# Altium project DCAC.PrjPcb (part 4 of 11)
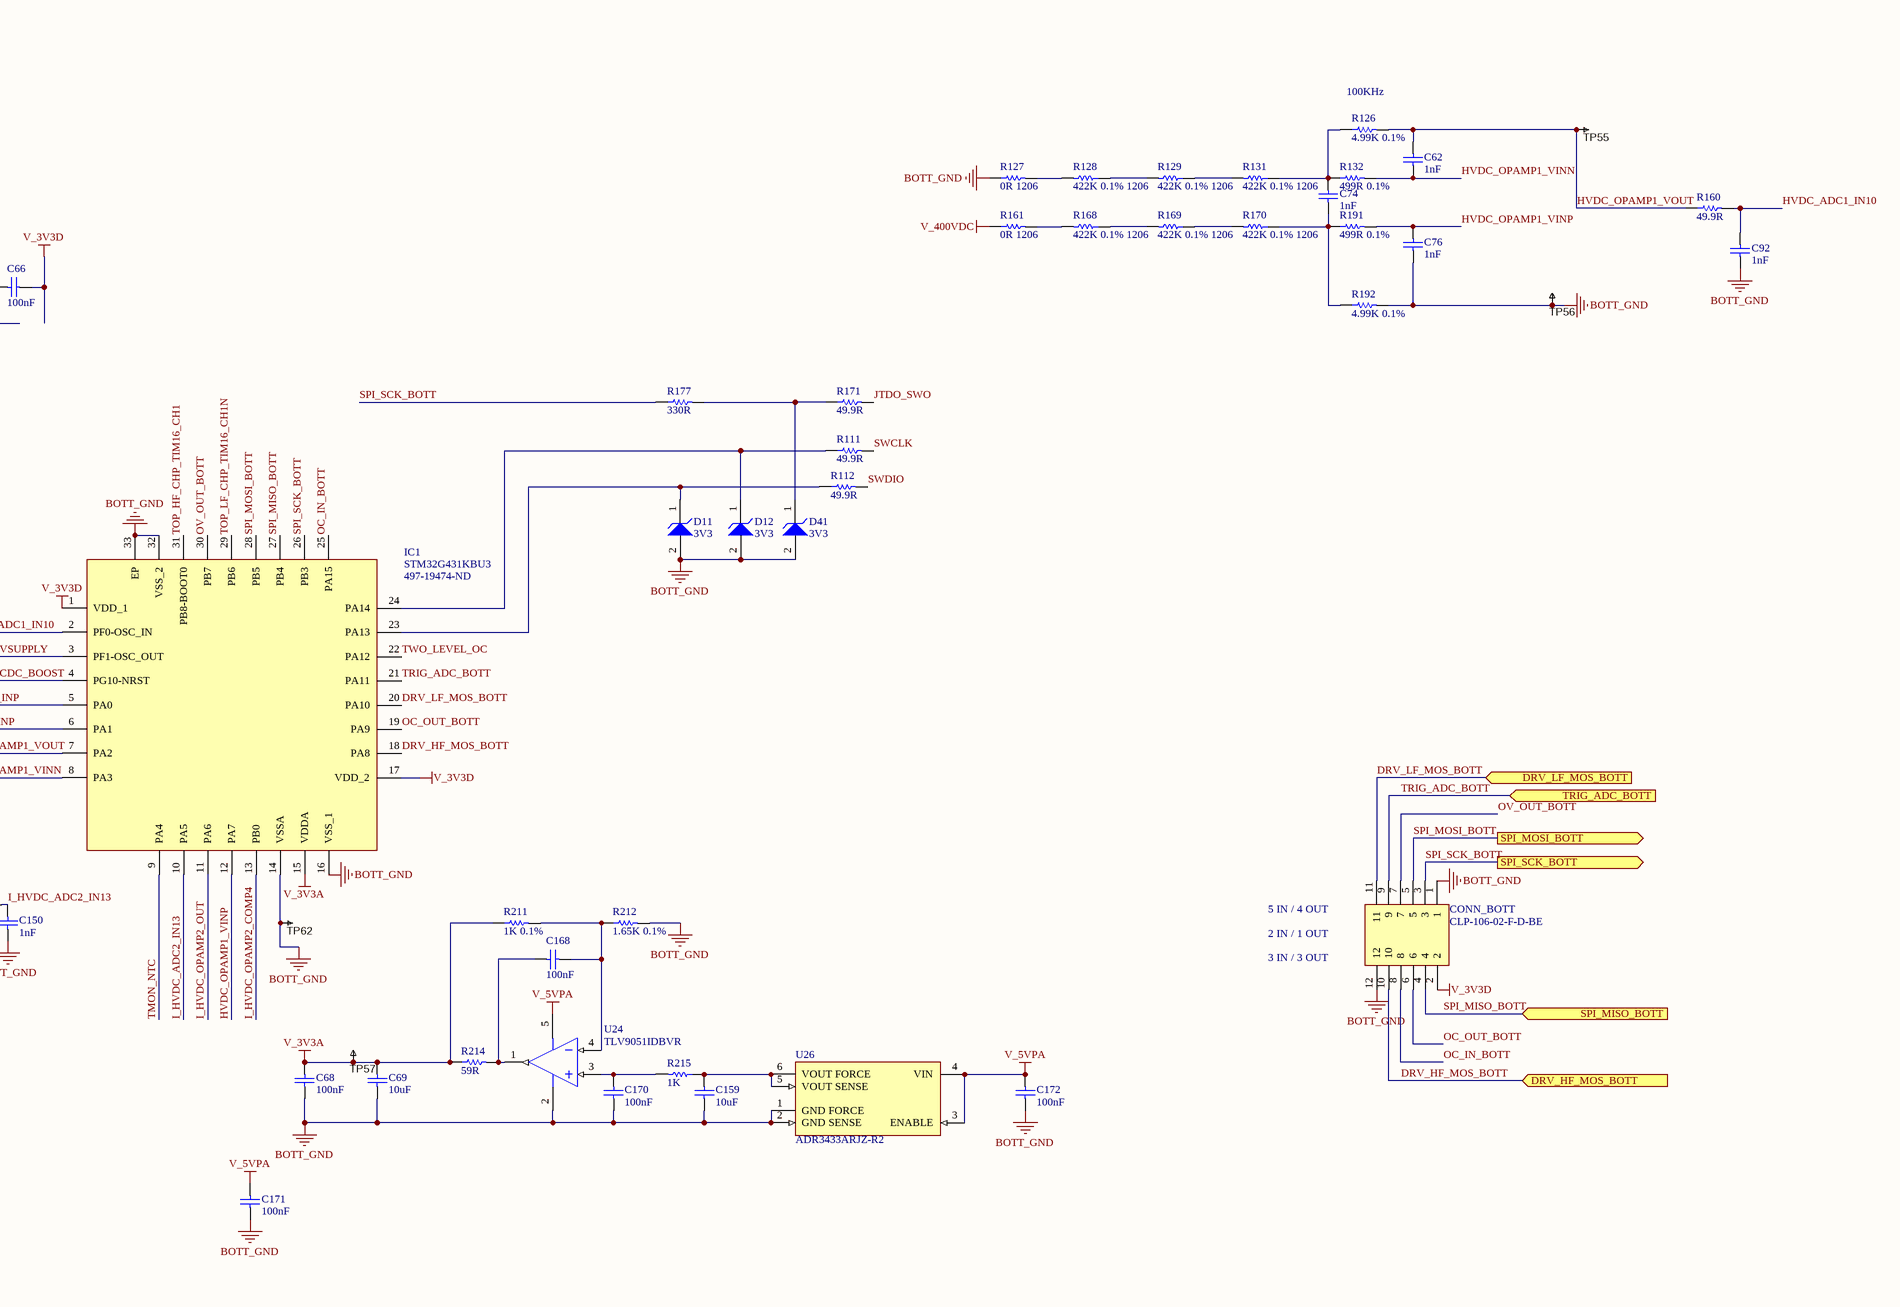
[diagram p14: Control_Sense_BOTT.SchDoc, bottom right]

## Sheet Control_Sense_BOTT.SchDoc (continued)

### Library data of the parts (continued)
R126 R192 = CMP-2000-00123-1: Part Number: ERA3AEB752V; Manufacturer: Panasonic; Manufacturer Part Number: ERA-3AEB752V; Resistance: 7.5kR; Power Rating: 100mW; Temperature Coefficient: 25ppm/°C; Voltage Rating: 75V; Supplier 1: Newark; Supplier Part Number 1: 39P9989; RoHS: Yes; Category: Chip SMD Resistors; Stock 1: 4505; Pricing 1: 1=0.35700, 25=0.30700, 50=0.21600, 100=0.12400, 250=0.10000, 500=0.07500, 1000=0.05100 (USD); Mount: Surface Mount; Case/Package: 0603; Number of Pins: 2; Case Code (Metric): 1608; Case Code (Imperial): 0603; Contact Plating: Tin; Size Code: 0603; Min Operating Temperature: -55°C; Max Operating Temperature: 155°C; Packaging: Tape and Reel; Resistor Type: Thin Film; Number of Terminations: 2; Max Power Dissipation: 100mW; Series: ERA-3A; Tolerance: 0.1%; Package Quantity: 5000; Voltage Rating (DC): 75V; Resistance Tolerance: 0.1%; Termination: SMD/SMT; Construction: Rectangular; Technology: THIN FILM; Length: 1.6mm; Width: 0.8mm; Height: 0.45mm; Depth: 0.8mm; Radiation Hardening: No; RoHS Compliant: Yes; Lead Free: Lead Free; REACH SVHC: No SVHC; Military Standard: Not; ComponentLink1URL: https://datasheet.ciiva.com/29183/451204-da-01-en-widerstand-0603-era-29183801.pdf?src-supplier=Conrad; ComponentLink1Description: https://datasheet.ciiva.com/29183/451204-da-01-en-widerstand-0603-era-29183801.pdf?src-supplier=Conrad; ComponentLink2URL: https://datasheet.ciiva.com/5867/485442-5867989.pdf?src-supplier=Farnell; ComponentLink2Description: https://datasheet.ciiva.com/5867/485442-5867989.pdf?src-supplier=Farnell; ComponentLink3URL: https://datasheet.ciiva.com/30091/54aoa0000ce26-30091989.pdf?src-supplier=Onlinecomponents.com; ComponentLink3Description: https://datasheet.ciiva.com/30091/54aoa0000ce26-30091989.pdf?src-supplier=Onlinecomponents.com; ComponentLink4URL: https://datasheet.ciiva.com/46449/485442-46449462.pdf?src-supplier=Element14; ComponentLink4Description: https://datasheet.ciiva.com/46449/485442-46449462.pdf?src-supplier=Element14; ComponentLink5URL: https://datasheet.ciiva.com/16774/70068849-16774823.pdf?src-supplier=Allied+Electronics; ComponentLink5Description: https://datasheet.ciiva.com/16774/70068849-16774823.pdf?src-supplier=Allied+Electronics; ComponentLink6URL: https://datasheet.ciiva.com/5867/485442-5867992.pdf?src-supplier=Farnell; ComponentLink6Description: https://datasheet.ciiva.com/5867/485442-5867992.pdf?src-supplier=Farnell; ComponentLink7URL: https://datasheet.ciiva.com/16774/70068849-16774360.pdf?src-supplier=Allied+Electronics; ComponentLink7Description: https://datasheet.ciiva.com/16774/70068849-16774360.pdf?src-supplier=Allied+Electronics; ComponentLink8URL: https://datasheet.ciiva.com/46387/485442-46387291.pdf?src-supplier=Element14; ComponentLink8Description: https://datasheet.ciiva.com/46387/485442-46387291.pdf?src-supplier=Element14; ComponentLink9URL: https://datasheet.ciiva.com/9194/aoa0000ce26-9194812.pdf?src-supplier=Avnet; ComponentLink9Description: https://datasheet.ciiva.com/9194/aoa0000ce26-9194812.pdf?src-supplier=Avnet; ComponentLink10URL: https://datasheet.ciiva.com/46387/485442-46387292.pdf?src-supplier=Element14; ComponentLink10Description: https://datasheet.ciiva.com/46387/485442-46387292.pdf?src-supplier=Element14; ComponentLink11URL: https://datasheet.ciiva.com/17212/aoa0000ce26-17212461.pdf?src-supplier=Avnet+Europe; ComponentLink11Description: https://datasheet.ciiva.com/17212/aoa0000ce26-17212461.pdf?src-supplier=Avnet+Europe; ComponentLink12URL: https://datasheet.ciiva.com/22740/485442-22740941.pdf?src-supplier=Element14; ComponentLink12Description: https://datasheet.ciiva.com/22740/485442-22740941.pdf?src-supplier=Element14; ComponentLink13URL: https://datasheet.ciiva.com/16395/aoa0000ce26-16395263.pdf?src-supplier=Future+Electronics; ComponentLink13Description: https://datasheet.ciiva.com/16395/aoa0000ce26-16395263.pdf?src-supplier=Future+Electronics
R127 R161 = CMP-2003-00541-1: Manufacturer: Panasonic; Part Number: ERJ-8GEY0R00V
R128 R129 R131 R168-R170 R239 R240 R242 = CMP-1014-00867-1: 1M5 0.25W 1% 1206 (3216 Metric)  SMD; Manufacturer: Yageo; Manufacturer Part Number: RT1206BRD07422KL; Case-EIA: 1206; Value: 1500000.00 Ohm; Case-Metric: 3216; Resistance: 422kR; Temperature Coefficient: 25ppm/°C; Power Rating: 250mW; Voltage Rating: 200V; Tolerance: 1 %; Power: 0.25 W; Technology: SMT; Supplier 1: Avnet; Supplier Part Number 1: RT1206BRD07422KL; RoHS: Yes; Category: Chip SMD Resistors; Pricing 1: 5000=0.04959, 10000=0.04889, 20000=0.04749, 30000=0.04644, 40000=0.04470, 50000=0.04365, 500000=0.04260 (USD); Case/Package: 1206; Case Code (Metric): 3216; Case Code (Imperial): 1206; Min Operating Temperature: -55°C; Max Operating Temperature: 125°C; Packaging: Tape and Reel; Series: RT; Number of Terminations: 2; Package Quantity: 5000; Max Power Dissipation: 250mW; Resistor Type: Thin Film; Termination: SMD/SMT; Voltage Rating (DC): 200V; Length: 0.122inch; Width: 0.063inch; Height: 0.026inch; RoHS Compliant: Yes; Lead Free: Lead Free; ComponentLink1URL: https://datasheet.ciiva.com/2587/pyu-rt-1-to-0-05-rohs-l-5-2587699.pdf?src-supplier=Digi-Key; ComponentLink1Description: https://datasheet.ciiva.com/2587/pyu-rt-1-to-0-05-rohs-l-5-2587699.pdf?src-supplier=Digi-Key; ComponentLink2URL: https://datasheet.ciiva.com/12702/pyu-rt-1-to-0-05-rohs-l-4-12702650.pdf?src-supplier=Mouser; ComponentLink2Description: https://datasheet.ciiva.com/12702/pyu-rt-1-to-0-05-rohs-l-4-12702650.pdf?src-supplier=Mouser
R132 R191 = CMP-2000-00076-1: Res Thin Film 0603 499 Ohm 0.1% 1/10W ±25ppm/°C Molded SMD SMD Punched Carrier T/R; Part Number: ERA3AEB4990V; Manufacturer: Panasonic; Manufacturer Part Number: ERA-3AEB4990V; Power Rating: 100mW; Voltage Rating: 150V; Voltage Rating (DC): 75V; Supplier 1: Digi-Key; Supplier Part Number 1: P499DBCT-ND; RoHS: Yes; Category: Chip SMD Resistors; Stock 1: 51561; Pricing 1: 1=0.31000, 10=0.26000, 100=0.10150, 1000=0.04248, 2500=0.03894 (USD); Mount: Surface Mount; Case/Package: 0603; Number of Pins: 2; Case Code (Metric): 1608; Case Code (Imperial): 0603; Contact Plating: Tin; Min Operating Temperature: -55°C; Max Operating Temperature: 155°C; Resistance: 499R; Tolerance: 0.1%; Packaging: Tape and Reel; Resistor Type: Thin Film,Metal Film; Temperature Coefficient: 25ppm/°C; Package Quantity: 1; Number of Terminations: 2; Termination: SMD/SMT; Max Power Dissipation: 100mW; Series: ERA-3A; Resistance Tolerance: 0.1%; Construction: Rectangular; Features: Automotive AEC-Q200; Technology: METAL FILM; Length: 1.6mm; Width: 0.8mm; Height: 0.45mm; Depth: 0.8mm; Radiation Hardening: No; RoHS Compliant: Yes; Lead Free: Lead Free; REACH SVHC: No SVHC; Military Standard: Not; ComponentLink1URL: https://datasheet.ciiva.com/11810/0900766b80eb1d8c-11810911.pdf?src-supplier=RSComponents; ComponentLink1Description: https://datasheet.ciiva.com/11810/0900766b80eb1d8c-11810911.pdf?src-supplier=RSComponents; ComponentLink2URL: https://datasheet.ciiva.com/29183/451973-da-01-en-widerstand-0603-era-29183924.pdf?src-supplier=Conrad; ComponentLink2Description: https://datasheet.ciiva.com/29183/451973-da-01-en-widerstand-0603-era-29183924.pdf?src-supplier=Conrad; ComponentLink3URL: https://datasheet.ciiva.com/9181/aoa0000ce26-9181477.pdf?src-supplier=Avnet; ComponentLink3Description: https://datasheet.ciiva.com/9181/aoa0000ce26-9181477.pdf?src-supplier=Avnet; ComponentLink4URL: https://datasheet.ciiva.com/17205/aoa0000ce26-17205477.pdf?src-supplier=Avnet+Europe; ComponentLink4Description: https://datasheet.ciiva.com/17205/aoa0000ce26-17205477.pdf?src-supplier=Avnet+Europe; ComponentLink5URL: https://datasheet.ciiva.com/30161/54aoa0000ce26-30161593.pdf?src-supplier=Onlinecomponents.com; ComponentLink5Description: https://datasheet.ciiva.com/30161/54aoa0000ce26-30161593.pdf?src-supplier=Onlinecomponents.com; ComponentLink6URL: https://datasheet.ciiva.com/7920/485442-7920378.pdf?src-supplier=Element14; ComponentLink6Description: https://datasheet.ciiva.com/7920/485442-7920378.pdf?src-supplier=Element14; ComponentLink7URL: https://datasheet.ciiva.com/7920/485442-7920379.pdf?src-supplier=Element14; ComponentLink7Description: https://datasheet.ciiva.com/7920/485442-7920379.pdf?src-supplier=Element14; ComponentLink8URL: https://datasheet.ciiva.com/6201/485442-6201036.pdf?src-supplier=Farnell; ComponentLink8Description: https://datasheet.ciiva.com/6201/485442-6201036.pdf?src-supplier=Farnell
R133 R247 = CMP-2100-03667-1: Chip Resistor, 0 Ohm, +/- 5%, 0.1 W, -55 to 155 degC, 0603 (1608 Metric), RoHS, Tape and Reel; Manufacturer: Yageo; Manufacturer Part Number: RC0603JR-070RL; Temperature Coefficient: 200ppm/degreesC; Voltage Rating: 50V; Power Rating: 100mW; Resistance: 0mOhm; Width: 0.8mm; Max Operating Temperature: 155degC; Tolerance: 5%; Package Reference: 0603; Height: 0.45mm; Depth: 0.8mm; Package Description: 2-Pin Surface Mount Device, Body 1.6 x 0.8 mm; Termination: SMD/SMT; Package Quantity: 5000; Case/Package: 0603; Case Code (Imperial): 0603; Radiation Hardening: No; Number of Pins: 2; Length: 1.6mm; Lead Free: LeadFree; Voltage Rating (DC): 50V; Military Standard: Not; Datasheet URL: http://www.yageo.com/NewPortal/yageodocoutput?fileName=/pdf/R-Chip/PYu-RC_Group_51_RoHS_L_5.pdf; Manufacturer URL: http://www.yageo.com/; Packaging: TapeandReel; Case Code (Metric): 1608; Min Operating Temperature: -55degC; Composition: ThickFilm; RoHSCompliant: true; Contact Plating: Tin; Datasheet Version: Rev. 5, 10/2016; REACH SVHC: NoSVHC; RoHS: Yes; Category: Chip SMD Resistors; Size Code: 0603; Resistor Type: Thick Film; Series: RC; Max Power Dissipation: 100mW; Construction: Rectangular; Number of Terminations: 2; Features: Moisture Resistant; Technology: THICK FILM; Resistance Tolerance: 5%; RoHS Compliant: Yes; ComponentLink1URL: https://datasheet.ciiva.com/11808/pyu-r-int-6-11808700.pdf?src-supplier=RSComponents; ComponentLink1Description: https://datasheet.ciiva.com/11808/pyu-r-int-6-11808700.pdf?src-supplier=RSComponents; ComponentLink2URL: https://datasheet.ciiva.com/22747/443971-22747530.pdf?src-supplier=Element14; ComponentLink2Description: https://datasheet.ciiva.com/22747/443971-22747530.pdf?src-supplier=Element14; ComponentLink3URL: https://datasheet.ciiva.com/12555/rc0603-272842-12555254.pdf?src-supplier=Mouser; ComponentLink3Description: https://datasheet.ciiva.com/12555/rc0603-272842-12555254.pdf?src-supplier=Mouser; ComponentLink4URL: https://datasheet.ciiva.com/7746/1738695-7746421.pdf?src-supplier=Element14; ComponentLink4Description: https://datasheet.ciiva.com/7746/1738695-7746421.pdf?src-supplier=Element14; ComponentLink5URL: https://datasheet.ciiva.com/7746/1738695-7746422.pdf?src-supplier=Element14; ComponentLink5Description: https://datasheet.ciiva.com/7746/1738695-7746422.pdf?src-supplier=Element14; ComponentLink6URL: https://datasheet.ciiva.com/8883/pyu-rc0603-51-rohs-l-4-8883045.pdf?src-supplier=Avnet; ComponentLink6Description: https://datasheet.ciiva.com/8883/pyu-rc0603-51-rohs-l-4-8883045.pdf?src-supplier=Avnet; ComponentLink7URL: https://datasheet.ciiva.com/15189/getdatasheetpartid-329462-15189845.pdf?src-supplier=Verical; ComponentLink7Description: https://datasheet.ciiva.com/15189/getdatasheetpartid-329462-15189845.pdf?src-supplier=Verical
  R133: Supplier 1: Digi-Key; Supplier Part Number 1: 311-0.0GRCT-ND; Stock 1: 3784489; Pricing 1: 1=0.10000, 10=0.01700, 25=0.01240, 50=0.00940, 100=0.00700, 250=0.00532, 500=0.00424, 1000=0.00313 (USD)
  R247: Supplier 1: Avnet; Supplier Part Number 1: RC0603JR-070RL; Stock 1: 1330000; Pricing 1: 5000=0.00138, 10000=0.00136, 20000=0.00132, 30000=0.00129, 40000=0.00124, 50000=0.00121, 500000=0.00118 (USD)
R160 R199 = CMP-2002-00969-1: 1/16W ±1% ±200ppm/℃ 49.9Ω 0402 Chip Resistor - Surface Mount ROHS; Manufacturer: Panasonic; Part Number: ERJ-2RKF49R9X; JLCPCB Part #: C25120
R174 R176 = RES_EMPTY_0805: Resistor, 0805 SMD, Empty footprint; Value: N/A; Package / Case: 0805 (2012 metric)
R178 R216 R222 = RES: 18kΩ ±1% ±100ppm/℃ 0.1W 0603 Chip Resistor - Surface Mount ROHS; Manufacturer: Panasonic; Part Number: ERA3AEB183V; Manufacturer Part Number: ERA-3AEB183V; Resistance: 18kR; Power Rating: 100mW; Tolerance: 0.1%; Temperature Coefficient: 25ppm/°C; Voltage Rating (DC): 75V; Supplier 1: Newark; Supplier Part Number 1: 08N2107; RoHS: Yes; Category: Chip SMD Resistors; Stock 1: 2207; Pricing 1: 1=0.35700, 25=0.30700, 50=0.21600, 100=0.12400, 250=0.10000, 500=0.07500, 1000=0.05100 (USD); Mount: Surface Mount; Case/Package: 0603; Number of Pins: 2; Case Code (Metric): 1608; Case Code (Imperial): 0603; Contact Plating: Tin; Size Code: 0603; Min Operating Temperature: -55°C; Max Operating Temperature: 155°C; Packaging: Tape and Reel; Resistor Type: Thin Film; Number of Terminations: 2; Max Power Dissipation: 100mW; Series: ERA-3A; Voltage Rating: 75V; Package Quantity: 1; Termination: SMD/SMT; Features: Automotive AEC-Q200; Resistance Tolerance: 0.1%; Construction: Rectangular; Technology: METAL FILM; Length: 1.6mm; Width: 0.8mm; Height: 0.45mm; Depth: 0.8mm; Radiation Hardening: No; RoHS Compliant: Yes; Lead Free: Lead Free; REACH SVHC: No SVHC; Military Standard: Not; ComponentLink1URL: https://datasheet.ciiva.com/11808/0900766b80fe20f7-11808020.pdf?src-supplier=RSComponents; ComponentLink1Description: https://datasheet.ciiva.com/11808/0900766b80fe20f7-11808020.pdf?src-supplier=RSComponents; ComponentLink2URL: https://datasheet.ciiva.com/29183/451333-da-01-en-widerstand-0603-era-29183823.pdf?src-supplier=Conrad; ComponentLink2Description: https://datasheet.ciiva.com/29183/451333-da-01-en-widerstand-0603-era-29183823.pdf?src-supplier=Conrad; ComponentLink3URL: https://datasheet.ciiva.com/16395/aoa0000ce26-16395253.pdf?src-supplier=Future+Electronics; ComponentLink3Description: https://datasheet.ciiva.com/16395/aoa0000ce26-16395253.pdf?src-supplier=Future+Electronics; ComponentLink4URL: https://datasheet.ciiva.com/16764/70068849-16764837.pdf?src-supplier=Allied+Electronics; ComponentLink4Description: https://datasheet.ciiva.com/16764/70068849-16764837.pdf?src-supplier=Allied+Electronics; ComponentLink5URL: https://datasheet.ciiva.com/9117/aoa0000ce26-9117398.pdf?src-supplier=Avnet; ComponentLink5Description: https://datasheet.ciiva.com/9117/aoa0000ce26-9117398.pdf?src-supplier=Avnet; ComponentLink6URL: https://datasheet.ciiva.com/17211/aoa0000ce26-17211238.pdf?src-supplier=Avnet+Europe; ComponentLink6Description: https://datasheet.ciiva.com/17211/aoa0000ce26-17211238.pdf?src-supplier=Avnet+Europe; ComponentLink7URL: https://datasheet.ciiva.com/22739/485442-22739288.pdf?src-supplier=Element14; ComponentLink7Description: https://datasheet.ciiva.com/22739/485442-22739288.pdf?src-supplier=Element14; ComponentLink8URL: https://datasheet.ciiva.com/48425/era-eng-tds-48425433.pdf?src-supplier=Distrelec; ComponentLink8Description: https://datasheet.ciiva.com/48425/era-eng-tds-48425433.pdf?src-supplier=Distrelec; ComponentLink9URL: https://datasheet.ciiva.com/48530/era-eng-tds-48530218.pdf?src-supplier=Distrelec; ComponentLink9Description: https://datasheet.ciiva.com/48530/era-eng-tds-48530218.pdf?src-supplier=Distrelec; ComponentLink10URL: https://datasheet.ciiva.com/5860/485442-5860507.pdf?src-supplier=Farnell; ComponentLink10Description: https://datasheet.ciiva.com/5860/485442-5860507.pdf?src-supplier=Farnell; ComponentLink11URL: https://datasheet.ciiva.com/16771/70068849-16771099.pdf?src-supplier=Allied+Electronics; ComponentLink11Description: https://datasheet.ciiva.com/16771/70068849-16771099.pdf?src-supplier=Allied+Electronics; ComponentLink12URL: https://datasheet.ciiva.com/5860/485442-5860508.pdf?src-supplier=Farnell; ComponentLink12Description: https://datasheet.ciiva.com/5860/485442-5860508.pdf?src-supplier=Farnell; ComponentLink13URL: https://datasheet.ciiva.com/7944/485442-7944492.pdf?src-supplier=Element14; ComponentLink13Description: https://datasheet.ciiva.com/7944/485442-7944492.pdf?src-supplier=Element14; ComponentLink14URL: https://datasheet.ciiva.com/30234/54aoa0000ce26-30234638.pdf?src-supplier=Onlinecomponents.com; ComponentLink14Description: https://datasheet.ciiva.com/30234/54aoa0000ce26-30234638.pdf?src-supplier=Onlinecomponents.com; ComponentLink15URL: https://datasheet.ciiva.com/46422/485442-46422590.pdf?src-supplier=Element14; ComponentLink15Description: https://datasheet.ciiva.com/46422/485442-46422590.pdf?src-supplier=Element14; ComponentLink16URL: https://datasheet.ciiva.com/46422/485442-46422591.pdf?src-supplier=Element14; ComponentLink16Description: https://datasheet.ciiva.com/46422/485442-46422591.pdf?src-supplier=Element14; Parameter 1: *; JLCPCB Part #: C25810
R198 = CMP-1012-00705-2: Manufacturer: Yageo; Part Number: RC0603FR-0752K3L; Tolerance: 1%; Resistance: 52.3kR; Temperature Coefficient: 100ppm/°C; Power Rating: 100mW; Voltage Rating: 75V; Voltage Rating (DC): 50V; Supplier 1: Digi-Key; Supplier Part Number 1: 311-52.3KHRCT-ND; Manufacturer Part Number: RC0603FR-0752K3L; RoHS: Yes; Category: Chip SMD Resistors; Stock 1: 193720; Pricing 1: 1=0.10000, 10=0.02400, 100=0.00970, 1000=0.00436, 2500=0.00378 (USD); Case/Package: 0603; Case Code (Imperial): 0603; Case Code (Metric): 1608; Weight: 7.1E-05oz; Size Code: 0603; Min Operating Temperature: -55°C; Max Operating Temperature: 155°C; Packaging: Tape and Reel; Resistor Type: Thick Film; Max Power Dissipation: 100mW; Number of Terminations: 2; Series: RC; Termination: SMD/SMT; Features: Moisture Resistant; Construction: Rectangular; Length: 1.6mm; Width: 0.8mm; Height: 0.45mm; Depth: 0.8mm; RoHS Compliant: Yes; Lead Free: Lead Free; Military Standard: Not; ComponentLink1URL: http://www.mouser.com/ds/2/447/RC0603-272842.pdf?src-supplier=Mouser; ComponentLink1Description: http://www.mouser.com/ds/2/447/RC0603-272842.pdf?src-supplier=Mouser; ComponentLink2URL: http://components.arrow.com/part/dataview/0323_03543171?src-supplier=Arrow+Europe; ComponentLink2Description: http://components.arrow.com/part/dataview/0323_03543171?src-supplier=Arrow+Europe; ComponentLink3URL: https://www.verical.com/server-webapp/html/getDatasheet?partID=326514&src-supplier=Verical; ComponentLink3Description: https://www.verical.com/server-webapp/html/getDatasheet?partID=326514&src-supplier=Verical; ComponentLink4URL: http://www.yageo.com/documents/recent/PYu-RC_Group_51_RoHS_L_10.pdf?src-supplier=Digi-Key; ComponentLink4Description: http://www.yageo.com/documents/recent/PYu-RC_Group_51_RoHS_L_10.pdf?src-supplier=Digi-Key; ComponentLink5URL: http://www.yageo.com/documents/recent/PYu-RC0603_51_RoHS_L_7.pdf?src-supplier=Future+Electronics; ComponentLink5Description: http://www.yageo.com/documents/recent/PYu-RC0603_51_RoHS_L_7.pdf?src-supplier=Future+Electronics
R205 R213 = CMP-2100-03663-1: Chip Resistor, 100 Ohm, +/- 1%, 0.1 W, -55 to 155 degC, 0603 (1608 Metric), RoHS, Tape and Reel; Manufacturer: Yageo; Manufacturer Part Number: RC0603FR-07100RL; Voltage Rating (DC): 50V; Power Rating: 100mW; Resistance: 100Ohm; Temperature Coefficient: 100ppm/degreesC; Number of Pins: 2; Tolerance: 1%; Height: 0.45mm; Manufacturer URL: http://www.yageo.com/; Military Standard: Not; Datasheet URL: http://www.yageo.com/NewPortal/yageodocoutput?fileName=/pdf/R-Chip/PYu-RC_Group_51_RoHS_L_5.pdf; Case Code (Imperial): 0603; Termination: SMD/SMT; Lead Free: LeadFree; Max Operating Temperature: 155degC; Case Code (Metric): 1608; RoHSCompliant: true; Voltage Rating: 50V; Width: 0.8mm; Composition: ThickFilm; Depth: 0.8mm; REACH SVHC: Unknown; Min Operating Temperature: -55degC; Packaging: TapeandReel; Package Description: 2-Pin Surface Mount Device, Body 1.6 x 0.8 mm; Length: 1.6mm; Package Reference: 0603; Datasheet Version: Rev. 5, 10/2016; Case/Package: 0603; Supplier 1: Digi-Key; Supplier Part Number 1: 311-100HRDKR-ND; RoHS: Yes; Category: Chip SMD Resistors; Stock 1: 21618328; Pricing 1: 1=0.10000, 10=0.02300, 100=0.00940, 1000=0.00421, 2500=0.00366 (USD); ComponentLink1URL: https://datasheet.ciiva.com/7660/38590-7660788.pdf?src-supplier=Element14; ComponentLink1Description: https://datasheet.ciiva.com/7660/38590-7660788.pdf?src-supplier=Element14; ComponentLink2URL: https://datasheet.ciiva.com/11808/0900766b80f96399-11808280.pdf?src-supplier=RSComponents; ComponentLink2Description: https://datasheet.ciiva.com/11808/0900766b80f96399-11808280.pdf?src-supplier=RSComponents; ComponentLink3URL: https://datasheet.ciiva.com/46440/1868787-46440890.pdf?src-supplier=Element14; ComponentLink3Description: https://datasheet.ciiva.com/46440/1868787-46440890.pdf?src-supplier=Element14; ComponentLink4URL: https://datasheet.ciiva.com/7746/1738695-7746237.pdf?src-supplier=Element14; ComponentLink4Description: https://datasheet.ciiva.com/7746/1738695-7746237.pdf?src-supplier=Element14; ComponentLink5URL: https://datasheet.ciiva.com/7746/1738695-7746238.pdf?src-supplier=Element14; ComponentLink5Description: https://datasheet.ciiva.com/7746/1738695-7746238.pdf?src-supplier=Element14; ComponentLink6URL: https://datasheet.ciiva.com/22747/443971-22747518.pdf?src-supplier=Element14; ComponentLink6Description: https://datasheet.ciiva.com/22747/443971-22747518.pdf?src-supplier=Element14
R206 = RES: ±1% ±200ppm/℃ 100Ω 0.1W 0603 Chip Resistor - Surface Mount ROHS; Manufacturer: Panasonic; Part Number: ERJ-3GEYJ101V; Parameter 1: *; JLCPCB Part #: C22775
R211 = CMP-2000-00873-1: Manufacturer: Panasonic; Part Number: ERA3AEB102V; Manufacturer Part Number: ERA-3AEB102V; Resistance: 1kR; Power Rating: 100mW; Temperature Coefficient: 25ppm/°C; Voltage Rating: 75V; Supplier 1: RSComponents; Supplier Part Number 1: 0566800P; RoHS: Yes; Category: Chip SMD Resistors; Stock 1: 1; Pricing 1: 5=0.38700, 50=0.32600, 250=0.12700, 1250=0.06600, 2500=0.04700 (USD); Mount: Surface Mount; Case/Package: 0603; Number of Pins: 2; Case Code (Imperial): 0603; Case Code (Metric): 1608; Contact Plating: Tin; Size Code: 0603; Min Operating Temperature: -55°C; Max Operating Temperature: 155°C; Packaging: Tape and Reel; Resistor Type: Thin Film; Tolerance: 0.1%; Number of Terminations: 2; Series: ERA-3A; Max Power Dissipation: 100mW; Construction: Rectangular; Package Quantity: 5000; Termination: SMD/SMT; Resistance Tolerance: 0.1%; Technology: METAL FILM; Length: 1.6mm; Width: 0.8mm; Height: 0.45mm; Depth: 0.8mm; Radiation Hardening: No; RoHS Compliant: Yes; Military Standard: Not; REACH SVHC: No SVHC; ComponentLink1URL: https://datasheet.ciiva.com/11808/0900766b80fe20f7-11808019.pdf?src-supplier=RSComponents; ComponentLink1Description: https://datasheet.ciiva.com/11808/0900766b80fe20f7-11808019.pdf?src-supplier=RSComponents; ComponentLink2URL: https://datasheet.ciiva.com/29183/450752-da-01-en-widerstand-0603-era-29183754.pdf?src-supplier=Conrad; ComponentLink2Description: https://datasheet.ciiva.com/29183/450752-da-01-en-widerstand-0603-era-29183754.pdf?src-supplier=Conrad; ComponentLink3URL: https://datasheet.ciiva.com/24071/aoa0000ce26-197354-24071510.pdf?src-supplier=Mouser; ComponentLink3Description: https://datasheet.ciiva.com/24071/aoa0000ce26-197354-24071510.pdf?src-supplier=Mouser; ComponentLink4URL: https://datasheet.ciiva.com/48530/era-eng-tds-48530582.pdf?src-supplier=Distrelec; ComponentLink4Description: https://datasheet.ciiva.com/48530/era-eng-tds-48530582.pdf?src-supplier=Distrelec; ComponentLink5URL: https://datasheet.ciiva.com/16781/70068849-16781703.pdf?src-supplier=Allied+Electronics; ComponentLink5Description: https://datasheet.ciiva.com/16781/70068849-16781703.pdf?src-supplier=Allied+Electronics; ComponentLink6URL: https://datasheet.ciiva.com/46422/1776116-46422455.pdf?src-supplier=Element14; ComponentLink6Description: https://datasheet.ciiva.com/46422/1776116-46422455.pdf?src-supplier=Element14; ComponentLink7URL: https://datasheet.ciiva.com/46422/485442-46422519.pdf?src-supplier=Element14; ComponentLink7Description: https://datasheet.ciiva.com/46422/485442-46422519.pdf?src-supplier=Element14; ComponentLink8URL: https://datasheet.ciiva.com/28531/485442-28531944.pdf?src-supplier=Element14; ComponentLink8Description: https://datasheet.ciiva.com/28531/485442-28531944.pdf?src-supplier=Element14; ComponentLink9URL: https://datasheet.ciiva.com/16426/aoa0000ce26-16426809.pdf?src-supplier=Future+Electronics; ComponentLink9Description: https://datasheet.ciiva.com/16426/aoa0000ce26-16426809.pdf?src-supplier=Future+Electronics; ComponentLink10URL: https://datasheet.ciiva.com/5734/aoa0000ce26-5734524.pdf?src-supplier=Farnell; ComponentLink10Description: https://datasheet.ciiva.com/5734/aoa0000ce26-5734524.pdf?src-supplier=Farnell; ComponentLink11URL: https://datasheet.ciiva.com/9198/aoa0000ce26-9198972.pdf?src-supplier=Avnet; ComponentLink11Description: https://datasheet.ciiva.com/9198/aoa0000ce26-9198972.pdf?src-supplier=Avnet; ComponentLink12URL: https://datasheet.ciiva.com/5734/485442-5734525.pdf?src-supplier=Farnell; ComponentLink12Description: https://datasheet.ciiva.com/5734/485442-5734525.pdf?src-supplier=Farnell; ComponentLink13URL: https://datasheet.ciiva.com/16725/70068849-16725038.pdf?src-supplier=Allied+Electronics; ComponentLink13Description: https://datasheet.ciiva.com/16725/70068849-16725038.pdf?src-supplier=Allied+Electronics; ComponentLink14URL: https://datasheet.ciiva.com/16853/aoa0000ce26-16853231.pdf?src-supplier=Avnet+Europe; ComponentLink14Description: https://datasheet.ciiva.com/16853/aoa0000ce26-16853231.pdf?src-supplier=Avnet+Europe; ComponentLink15URL: https://datasheet.ciiva.com/46393/1776116-46393695.pdf?src-supplier=Element14; ComponentLink15Description: https://datasheet.ciiva.com/46393/1776116-46393695.pdf?src-supplier=Element14
R212 = CMP-2000-00927-1: Part Number: ERA3AEB1651V; Manufacturer: Panasonic; Manufacturer Part Number: ERA-3AEB1651V; Resistance: 1.65kR; Power Rating: 100mW; Voltage Rating: 75V; Temperature Coefficient: 25ppm/°C; Supplier 1: Digi-Key; Supplier Part Number 1: P1.65KDBCT-ND; RoHS: Yes; Category: Chip SMD Resistors; Stock 1: 109834; Pricing 1: 1=0.31000, 10=0.26000, 100=0.10150, 1000=0.04248, 2500=0.03894 (USD); Mount: Surface Mount; Case/Package: 0603; Number of Pins: 2; Case Code (Imperial): 0603; Case Code (Metric): 1608; Contact Plating: Tin; Min Operating Temperature: -55°C; Max Operating Temperature: 155°C; Packaging: Tape and Reel; Tolerance: 0.1%; Resistor Type: Metal Film,Thin Film; Number of Terminations: 2; Package Quantity: 1; Voltage Rating (DC): 75V; Max Power Dissipation: 100mW; Features: Automotive AEC-Q200; Length: 1.6mm; Width: 0.8mm; Height: 0.45mm; Depth: 0.8mm; Radiation Hardening: No; REACH SVHC: No SVHC; Lead Free: Lead Free; Military Standard: Not; ComponentLink1URL: https://datasheet.ciiva.com/11809/0900766b80eb1d8c-11809743.pdf?src-supplier=RSComponents; ComponentLink1Description: https://datasheet.ciiva.com/11809/0900766b80eb1d8c-11809743.pdf?src-supplier=RSComponents; ComponentLink2URL: https://datasheet.ciiva.com/29183/451859-da-01-en-widerstand-0603-era-29183902.pdf?src-supplier=Conrad; ComponentLink2Description: https://datasheet.ciiva.com/29183/451859-da-01-en-widerstand-0603-era-29183902.pdf?src-supplier=Conrad; ComponentLink3URL: https://datasheet.ciiva.com/9197/aoa0000ce26-9197850.pdf?src-supplier=Avnet; ComponentLink3Description: https://datasheet.ciiva.com/9197/aoa0000ce26-9197850.pdf?src-supplier=Avnet; ComponentLink4URL: https://datasheet.ciiva.com/17214/aoa0000ce26-17214586.pdf?src-supplier=Avnet+Europe; ComponentLink4Description: https://datasheet.ciiva.com/17214/aoa0000ce26-17214586.pdf?src-supplier=Avnet+Europe; ComponentLink5URL: https://datasheet.ciiva.com/7920/485442-7920363.pdf?src-supplier=Element14; ComponentLink5Description: https://datasheet.ciiva.com/7920/485442-7920363.pdf?src-supplier=Element14; ComponentLink6URL: https://datasheet.ciiva.com/7920/485442-7920364.pdf?src-supplier=Element14; ComponentLink6Description: https://datasheet.ciiva.com/7920/485442-7920364.pdf?src-supplier=Element14
R214 = CMP-2000-00583-1: Manufacturer: Panasonic; Part Number: ERJ-3EKF59R0V; Power Rating: 100mW; Tolerance: 1%; Temperature Coefficient: 100ppm/°C; Voltage Rating: 75V; Voltage Rating (DC): 50V; Supplier 1: Digi-Key; Supplier Part Number 1: P59.0HCT-ND; Manufacturer Part Number: ERJ-3EKF59R0V; RoHS: Yes; Category: Chip SMD Resistors; Stock 1: 39151; Pricing 1: 1=0.10000, 10=0.03700, 100=0.01490, 1000=0.00670, 2500=0.00582 (USD); Mount: Surface Mount; Case/Package: 0603; Case Code (Metric): 1608; Case Code (Imperial): 0603; Contact Plating: Tin; Min Operating Temperature: -55°C; Max Operating Temperature: 155°C; Resistance: 59R; Packaging: Tape and Reel; Resistor Type: Thick Film; Number of Terminations: 2; Package Quantity: 1; Series: ERJ; Max Power Dissipation: 100mW; Termination: SMD/SMT; Resistance Tolerance: 1%; Features: Automotive AEC-Q200; Technology: THICK FILM; Construction: Rectangular; Length: 1.6mm; Width: 0.031inch; Height: 0.45mm; Depth: 0.8mm; RoHS Compliant: Yes; REACH SVHC: Yes; Lead Free: Contains Lead; Military Standard: Not; ComponentLink1URL: https://datasheet.ciiva.com/9188/aoa0000ce2-9188485.pdf?src-supplier=Avnet; ComponentLink1Description: https://datasheet.ciiva.com/9188/aoa0000ce2-9188485.pdf?src-supplier=Avnet; ComponentLink2URL: https://datasheet.ciiva.com/46420/1678782-46420341.pdf?src-supplier=Element14; ComponentLink2Description: https://datasheet.ciiva.com/46420/1678782-46420341.pdf?src-supplier=Element14; ComponentLink3URL: https://datasheet.ciiva.com/22729/1678782-22729158.pdf?src-supplier=Farnell; ComponentLink3Description: https://datasheet.ciiva.com/22729/1678782-22729158.pdf?src-supplier=Farnell; ComponentLink4URL: https://datasheet.ciiva.com/22673/1678782-22673800.pdf?src-supplier=Element14; ComponentLink4Description: https://datasheet.ciiva.com/22673/1678782-22673800.pdf?src-supplier=Element14; ComponentLink5URL: https://datasheet.ciiva.com/9188/aoa0000ce2-9188489.pdf?src-supplier=Avnet; ComponentLink5Description: https://datasheet.ciiva.com/9188/aoa0000ce2-9188489.pdf?src-supplier=Avnet; ComponentLink6URL: https://datasheet.ciiva.com/30242/aoa0000ce2-30242153.pdf?src-supplier=Onlinecomponents.com; ComponentLink6Description: https://datasheet.ciiva.com/30242/aoa0000ce2-30242153.pdf?src-supplier=Onlinecomponents.com; ComponentLink7URL: https://datasheet.ciiva.com/16777/70260748-16777979.pdf?src-supplier=Allied+Electronics; ComponentLink7Description: https://datasheet.ciiva.com/16777/70260748-16777979.pdf?src-supplier=Allied+Electronics
R215 R232 R243 = RES: ±1% ±100ppm/℃ 1kΩ 0.1W 0603 Chip Resistor - Surface Mount ROHS; Part Number: ERJ-3EKF1001V; Manufacturer: Panasonic; Manufacturer Part Number: ERJ3EKF1001V; Resistance: 1kR; Power Rating: 100mW; Voltage Rating: 75V; Temperature Coefficient: 100ppm/°C; Supplier 1: Future Electronics; Supplier Part Number 1: 3028514; RoHS: Yes; Category: Chip SMD Resistors; Stock 1: 430000; Pricing 1: 5000=0.01860, 10000=0.01510, 15000=0.01500, 20000=0.01490 (USD); Mount: Surface Mount; Case/Package: 0603; Number of Pins: 2; Case Code (Metric): 1608; Case Code (Imperial): 0603; Contact Plating: Tin; Size Code: 0603; Min Operating Temperature: -55°C; Max Operating Temperature: 155°C; Packaging: Tape and Reel; Tolerance: 1%; Termination: SMD/SMT; Package Quantity: 5000; Series: ERJ; Resistor Type: Thick Film; Max Power Dissipation: 100mW; Construction: Rectangular; Resistance Tolerance: 1%; Number of Terminations: 2; Features: Automotive AEC-Q200; Voltage Rating (DC): 75V; Technology: THICK FILM; Length: 1.6mm; Width: 0.8mm; Height: 0.45mm; Depth: 0.8mm; Radiation Hardening: No; REACH SVHC: No SVHC; Lead Free: Lead Free; RoHS Compliant: Yes; Military Standard: Not; ComponentLink1URL: https://datasheet.ciiva.com/16768/70260748-16768437.pdf?src-supplier=Allied+Electronics; ComponentLink1Description: https://datasheet.ciiva.com/16768/70260748-16768437.pdf?src-supplier=Allied+Electronics; ComponentLink2URL: https://datasheet.ciiva.com/16774/70260748-16774550.pdf?src-supplier=Allied+Electronics; ComponentLink2Description: https://datasheet.ciiva.com/16774/70260748-16774550.pdf?src-supplier=Allied+Electronics; ComponentLink3URL: https://datasheet.ciiva.com/16449/aoa0000ce2-16449065.pdf?src-supplier=Future+Electronics; ComponentLink3Description: https://datasheet.ciiva.com/16449/aoa0000ce2-16449065.pdf?src-supplier=Future+Electronics; ComponentLink4URL: https://datasheet.ciiva.com/7942/aoa0000ce2-7942427.pdf?src-supplier=Element14; ComponentLink4Description: https://datasheet.ciiva.com/7942/aoa0000ce2-7942427.pdf?src-supplier=Element14; ComponentLink5URL: https://datasheet.ciiva.com/9198/aoa0000ce2-9198923.pdf?src-supplier=Avnet; ComponentLink5Description: https://datasheet.ciiva.com/9198/aoa0000ce2-9198923.pdf?src-supplier=Avnet; ComponentLink6URL: https://datasheet.ciiva.com/46373/1678782-46373339.pdf?src-supplier=Element14; ComponentLink6Description: https://datasheet.ciiva.com/46373/1678782-46373339.pdf?src-supplier=Element14; ComponentLink7URL: https://datasheet.ciiva.com/48530/aoa0000ce2-48530987.pdf?src-supplier=Avnet; ComponentLink7Description: https://datasheet.ciiva.com/48530/aoa0000ce2-48530987.pdf?src-supplier=Avnet; ComponentLink8URL: https://datasheet.ciiva.com/46373/1678782-46373340.pdf?src-supplier=Element14; ComponentLink8Description: https://datasheet.ciiva.com/46373/1678782-46373340.pdf?src-supplier=Element14; ComponentLink9URL: https://datasheet.ciiva.com/24070/aoa0000ce2-24070269.pdf?src-supplier=Mouser; ComponentLink9Description: https://datasheet.ciiva.com/24070/aoa0000ce2-24070269.pdf?src-supplier=Mouser; ComponentLink10URL: https://datasheet.ciiva.com/22673/1678782-22673918.pdf?src-supplier=Element14; ComponentLink10Description: https://datasheet.ciiva.com/22673/1678782-22673918.pdf?src-supplier=Element14; ComponentLink11URL: https://datasheet.ciiva.com/30063/aoa0000ce2-30063390.pdf?src-supplier=Onlinecomponents.com; ComponentLink11Description: https://datasheet.ciiva.com/30063/aoa0000ce2-30063390.pdf?src-supplier=Onlinecomponents.com; ComponentLink12URL: https://datasheet.ciiva.com/17215/aoa0000ce2-17215311.pdf?src-supplier=Avnet+Europe; ComponentLink12Description: https://datasheet.ciiva.com/17215/aoa0000ce2-17215311.pdf?src-supplier=Avnet+Europe; Parameter 1: *; JLCPCB Part #: C21190
R238 = RES: ±1% 4.7kΩ ±100ppm/℃ 0.1W 0603 Chip Resistor - Surface Mount ROHS; Manufacturer: Panasonic; Part Number: ERJ-3EKF1602V; Parameter 1: *; JLCPCB Part #: C23162
R241 = CMP-2000-00874-1: Part Number: ERA-3AEB103V; Manufacturer: Panasonic
R248 = CMP-2000-00369-1: Manufacturer: Panasonic; Part Number: ERJ-3EKF2491V; Resistance: 2.49kR; Power Rating: 100mW; Temperature Coefficient: 100ppm/°C; Tolerance: 1%; Voltage Rating: 75V; Voltage Rating (DC): 50V; Supplier 1: RSComponents; Supplier Part Number 1: 1065939; Manufacturer Part Number: ERJ-3EKF2491V; RoHS: Yes; Category: Chip SMD Resistors; Stock 1: 5000; Pricing 1: 5000=0.00600, 5000=0.00400 (USD); Mount: Surface Mount; Case/Package: 0603; Case Code (Metric): 1608; Case Code (Imperial): 0603; Contact Plating: Tin; Min Operating Temperature: -55°C; Max Operating Temperature: 155°C; Packaging: Tape and Reel; Resistor Type: Thick Film; Series: ERJ; Number of Terminations: 2; Max Power Dissipation: 100mW; Termination: SMD/SMT; Package Quantity: 1; Features: Automotive AEC-Q200; Resistance Tolerance: 1%; Construction: Rectangular; Technology: THICK FILM; Working Voltage: 75V; Length: 1.6mm; Width: 0.031inch; Height: 0.45mm; Depth: 0.8mm; Radiation Hardening: No; RoHS Compliant: Yes; Lead Free: Lead Free; REACH SVHC: No SVHC; Military Standard: Not; ComponentLink1URL: https://datasheet.ciiva.com/34303/1987855-34303585.pdf?src-supplier=Jameco; ComponentLink1Description: https://datasheet.ciiva.com/34303/1987855-34303585.pdf?src-supplier=Jameco; ComponentLink2URL: https://datasheet.ciiva.com/43460/426256-43460491.pdf?src-supplier=Farnell; ComponentLink2Description: https://datasheet.ciiva.com/43460/426256-43460491.pdf?src-supplier=Farnell; ComponentLink3URL: https://datasheet.ciiva.com/5969/426256-5969254.pdf?src-supplier=Farnell; ComponentLink3Description: https://datasheet.ciiva.com/5969/426256-5969254.pdf?src-supplier=Farnell; ComponentLink4URL: https://datasheet.ciiva.com/22749/1678782-22749613.pdf?src-supplier=Element14; ComponentLink4Description: https://datasheet.ciiva.com/22749/1678782-22749613.pdf?src-supplier=Element14; ComponentLink5URL: https://datasheet.ciiva.com/28694/1678782-28694214.pdf?src-supplier=Element14; ComponentLink5Description: https://datasheet.ciiva.com/28694/1678782-28694214.pdf?src-supplier=Element14; ComponentLink6URL: https://datasheet.ciiva.com/30200/aoa0000ce2-30200873.pdf?src-supplier=Onlinecomponents.com; ComponentLink6Description: https://datasheet.ciiva.com/30200/aoa0000ce2-30200873.pdf?src-supplier=Onlinecomponents.com; ComponentLink7URL: https://datasheet.ciiva.com/15159/getdatasheetpartid-28728-15159196.pdf?src-supplier=Verical; ComponentLink7Description: https://datasheet.ciiva.com/15159/getdatasheetpartid-28728-15159196.pdf?src-supplier=Verical
R250 = CMP-2000-00304-1: Part Number: ERJ-3EKF1872V; Manufacturer: Panasonic; Manufacturer Part Number: ERJ3EKF1872V; Resistance: 18.7kR; Tolerance: 1%; Power Rating: 100mW; Temperature Coefficient: 100ppm/°C; Voltage Rating: 75V; Voltage Rating (DC): 50V; Supplier 1: Digi-Key; Supplier Part Number 1: P18.7KHCT-ND; RoHS: Yes; Category: Chip SMD Resistors; Stock 1: 46053; Pricing 1: 1=0.10000, 10=0.03700, 100=0.01490, 1000=0.00670, 2500=0.00582 (USD); Mount: Surface Mount; Case/Package: 0603; Case Code (Metric): 1608; Case Code (Imperial): 0603; Contact Plating: Tin; Min Operating Temperature: -55°C; Max Operating Temperature: 155°C; Packaging: Tape and Reel; Resistor Type: Thick Film; Number of Terminations: 2; Max Power Dissipation: 100mW; Series: ERJ; Termination: SMD/SMT; Package Quantity: 5000; Features: Automotive AEC-Q200; Construction: Rectangular; Resistance Tolerance: 1%; Technology: THICK FILM; Length: 1.6mm; Width: 0.031inch; Height: 0.45mm; Depth: 0.8mm; RoHS Compliant: Yes; Lead Free: Lead Free; Military Standard: Not; REACH SVHC: No SVHC; ComponentLink1URL: https://datasheet.ciiva.com/46389/426256-46389543.pdf?src-supplier=Element14; ComponentLink1Description: https://datasheet.ciiva.com/46389/426256-46389543.pdf?src-supplier=Element14; ComponentLink2URL: https://datasheet.ciiva.com/46377/426256-46377847.pdf?src-supplier=Element14; ComponentLink2Description: https://datasheet.ciiva.com/46377/426256-46377847.pdf?src-supplier=Element14; ComponentLink3URL: https://datasheet.ciiva.com/24027/aoa0000ce2-24027197.pdf?src-supplier=Mouser; ComponentLink3Description: https://datasheet.ciiva.com/24027/aoa0000ce2-24027197.pdf?src-supplier=Mouser; ComponentLink4URL: https://datasheet.ciiva.com/16771/70260748-16771897.pdf?src-supplier=Allied+Electronics; ComponentLink4Description: https://datasheet.ciiva.com/16771/70260748-16771897.pdf?src-supplier=Allied+Electronics; ComponentLink5URL: https://datasheet.ciiva.com/9192/aoa0000ce2-9192315.pdf?src-supplier=Avnet; ComponentLink5Description: https://datasheet.ciiva.com/9192/aoa0000ce2-9192315.pdf?src-supplier=Avnet; ComponentLink6URL: https://datasheet.ciiva.com/30054/aoa0000ce2-30054763.pdf?src-supplier=Onlinecomponents.com; ComponentLink6Description: https://datasheet.ciiva.com/30054/aoa0000ce2-30054763.pdf?src-supplier=Onlinecomponents.com
R251 = CMP-2000-03619-1: Part Number: CRCW06038K06FKEA; Manufacturer: Vishay Dale; Resistance: 8.06kR; Tolerance: 1%; Temperature Coefficient: 100ppm/°C; Max Power Dissipation: 100mW; Voltage Rating (DC): 75V; Supplier 1: RSComponents; Supplier Part Number 1: 6790740; Manufacturer Part Number: CRCW06038K06FKEA; RoHS: Yes; Category: Chip SMD Resistors; Stock 1: 19100; Pricing 1: 50=0.03200, 250=0.02900, 500=0.02800, 1000=0.02500, 2500=0.02400, 50=0.02300, 250=0.02100, 500=0.02000, 1000=0.01800, 2500=0.01700 (USD); Mount: Surface Mount; Case/Package: 0603; Case Code (Imperial): 0603; Case Code (Metric): 1608; Contact Plating: Tin; Size Code: 0603; Weight: 7.1E-05oz; Min Operating Temperature: -55°C; Max Operating Temperature: 155°C; Packaging: Tape and Reel; Resistor Type: Thick Film; Number of Terminations: 2; Series: CRCW; Power Rating: 100mW; Package Quantity: 10; Voltage Rating: 75V; Termination: SMD/SMT; Features: Automotive AEC-Q200; Resistance Tolerance: 1%; Construction: Rectangular; Technology: THICK FILM; Length: 1.55mm; Width: 0.85mm; Height: 0.45mm; Depth: 0.85mm; Radiation Hardening: No; RoHS Compliant: Yes; Lead Free: Lead Free; REACH SVHC: Unknown; Military Standard: Not; ComponentLink1URL: https://datasheet.ciiva.com/11808/0900766b80d98afc-11808688.pdf?src-supplier=RSComponents; ComponentLink1Description: https://datasheet.ciiva.com/11808/0900766b80d98afc-11808688.pdf?src-supplier=RSComponents; ComponentLink2URL: https://datasheet.ciiva.com/16883/dcrcwe3-16883509.pdf?src-supplier=Avnet+Europe; ComponentLink2Description: https://datasheet.ciiva.com/16883/dcrcwe3-16883509.pdf?src-supplier=Avnet+Europe; ComponentLink3URL: https://datasheet.ciiva.com/5547/dcrcwe3-109170-5547383.pdf?src-supplier=Mouser; ComponentLink3Description: https://datasheet.ciiva.com/5547/dcrcwe3-109170-5547383.pdf?src-supplier=Mouser; ComponentLink4URL: https://datasheet.ciiva.com/2466/dcrcwe3-2466248.pdf?src-supplier=Digi-Key; ComponentLink4Description: https://datasheet.ciiva.com/2466/dcrcwe3-2466248.pdf?src-supplier=Digi-Key; ComponentLink5URL: https://datasheet.ciiva.com/2466/dcrcwe3-2466249.pdf?src-supplier=Digi-Key; ComponentLink5Description: https://datasheet.ciiva.com/2466/dcrcwe3-2466249.pdf?src-supplier=Digi-Key; ComponentLink6URL: https://datasheet.ciiva.com/2466/dcrcwe3-2466250.pdf?src-supplier=Digi-Key; ComponentLink6Description: https://datasheet.ciiva.com/2466/dcrcwe3-2466250.pdf?src-supplier=Digi-Key; ComponentLink7URL: https://datasheet.ciiva.com/7690/1697337-7690746.pdf?src-supplier=Element14; ComponentLink7Description: https://datasheet.ciiva.com/7690/1697337-7690746.pdf?src-supplier=Element14; ComponentLink8URL: https://datasheet.ciiva.com/7792/125364-7792426.pdf?src-supplier=Element14; ComponentLink8Description: https://datasheet.ciiva.com/7792/125364-7792426.pdf?src-supplier=Element14; ComponentLink9URL: https://datasheet.ciiva.com/7690/1697337-7690747.pdf?src-supplier=Element14; ComponentLink9Description: https://datasheet.ciiva.com/7690/1697337-7690747.pdf?src-supplier=Element14; ComponentLink10URL: https://datasheet.ciiva.com/16766/70201119-16766572.pdf?src-supplier=Allied+Electronics; ComponentLink10Description: https://datasheet.ciiva.com/16766/70201119-16766572.pdf?src-supplier=Allied+Electronics; ComponentLink11URL: https://datasheet.ciiva.com/3257/dcrcwe3-3257950.pdf?src-supplier=Avnet; ComponentLink11Description: https://datasheet.ciiva.com/3257/dcrcwe3-3257950.pdf?src-supplier=Avnet; ComponentLink12URL: https://datasheet.ciiva.com/16435/dcrcwe3-16435966.pdf?src-supplier=Future+Electronics; ComponentLink12Description: https://datasheet.ciiva.com/16435/dcrcwe3-16435966.pdf?src-supplier=Future+Electronics; ComponentLink13URL: https://datasheet.ciiva.com/16514/dcrcwe3-16514894.pdf?src-supplier=Avnet+Asia; ComponentLink13Description: https://datasheet.ciiva.com/16514/dcrcwe3-16514894.pdf?src-supplier=Avnet+Asia; ComponentLink14URL: https://datasheet.ciiva.com/22707/1697337-22707758.pdf?src-supplier=Element14; ComponentLink14Description: https://datasheet.ciiva.com/22707/1697337-22707758.pdf?src-supplier=Element14; ComponentLink15URL: https://datasheet.ciiva.com/3257/dcrcwe3-3257951.pdf?src-supplier=Avnet; ComponentLink15Description: https://datasheet.ciiva.com/3257/dcrcwe3-3257951.pdf?src-supplier=Avnet
R252 R253 = RES: S, THICK FILM, 33K, 100mW, 1%, 0402, FULL REEL; Product Range:PANASONIC - ERJ Series; Resistance:33kohm; Power Rating:100mW; Resistance Tolerance:± 1%; Resistor Case Style:0402 ^1005 Metric]; Resistor Element Type:Thick Film; Part Number: ERJ2RKF3302X; Manufacturer Part Number: ERJ-2RKF3302X; Resistance: 33kR; Voltage Rating: 50V; Temperature Coefficient: 100ppm/°C; Manufacturer: Panasonic; Supplier 1: Digi-Key; Supplier Part Number 1: P33.0KLCT-ND; RoHS: Yes; Category: Chip SMD Resistors; Stock 1: 8872; Pricing 1: 1=0.10000, 10=0.02500, 100=0.01020, 1000=0.00457, 2500=0.00397, 5000=0.00328 (USD); Mount: Surface Mount; Case/Package: 0402; Number of Pins: 2; Case Code (Metric): 1005; Case Code (Imperial): 0402; Contact Plating: Tin; Min Operating Temperature: -55°C; Max Operating Temperature: 155°C; Packaging: Tape and Reel; Tolerance: 1%; Power Rating: 100mW; Termination: SMD/SMT; Resistor Type: Thick Film; Max Power Dissipation: 100mW; Number of Terminations: 2; Package Quantity: 1; Voltage Rating (DC): 50V; Features: Automotive AEC-Q200; Length: 1mm; Width: 0.02inch; Height: 0.35mm; Depth: 0.5mm; Radiation Hardening: No; Military Standard: Not; Lead Free: Lead Free; REACH SVHC: No SVHC; ComponentLink1URL: https://datasheet.ciiva.com/11821/0900766b80f80784-11821294.pdf?src-supplier=RSComponents; ComponentLink1Description: https://datasheet.ciiva.com/11821/0900766b80f80784-11821294.pdf?src-supplier=RSComponents; ComponentLink2URL: https://datasheet.ciiva.com/16784/70260748-16784773.pdf?src-supplier=Allied+Electronics; ComponentLink2Description: https://datasheet.ciiva.com/16784/70260748-16784773.pdf?src-supplier=Allied+Electronics; ComponentLink3URL: https://datasheet.ciiva.com/22673/1678782-22673685.pdf?src-supplier=Element14; ComponentLink3Description: https://datasheet.ciiva.com/22673/1678782-22673685.pdf?src-supplier=Element14; ComponentLink4URL: https://datasheet.ciiva.com/22737/426256-22737285.pdf?src-supplier=Element14; ComponentLink4Description: https://datasheet.ciiva.com/22737/426256-22737285.pdf?src-supplier=Element14; ComponentLink5URL: https://datasheet.ciiva.com/30159/aoa0000ce2-30159014.pdf?src-supplier=Onlinecomponents.com; ComponentLink5Description: https://datasheet.ciiva.com/30159/aoa0000ce2-30159014.pdf?src-supplier=Onlinecomponents.com; ComponentLink6URL: https://datasheet.ciiva.com/9190/aoa0000ce2-9190679.pdf?src-supplier=Avnet; ComponentLink6Description: https://datasheet.ciiva.com/9190/aoa0000ce2-9190679.pdf?src-supplier=Avnet; ComponentLink7URL: https://datasheet.ciiva.com/17210/aoa0000ce2-17210312.pdf?src-supplier=Avnet+Europe; ComponentLink7Description: https://datasheet.ciiva.com/17210/aoa0000ce2-17210312.pdf?src-supplier=Avnet+Europe; ComponentLink8URL: https://datasheet.ciiva.com/7802/aoa0000ce2-7802409.pdf?src-supplier=Element14; ComponentLink8Description: https://datasheet.ciiva.com/7802/aoa0000ce2-7802409.pdf?src-supplier=Element14; ComponentLink9URL: https://datasheet.ciiva.com/46420/1678782-46420317.pdf?src-supplier=Element14; ComponentLink9Description: https://datasheet.ciiva.com/46420/1678782-46420317.pdf?src-supplier=Element14; ComponentLink10URL: https://datasheet.ciiva.com/24024/aoa0000ce2-24024398.pdf?src-supplier=Mouser; ComponentLink10Description: https://datasheet.ciiva.com/24024/aoa0000ce2-24024398.pdf?src-supplier=Mouser; ComponentLink11URL: https://datasheet.ciiva.com/22687/1678782-22687071.pdf?src-supplier=Element14; ComponentLink11Description: https://datasheet.ciiva.com/22687/1678782-22687071.pdf?src-supplier=Element14